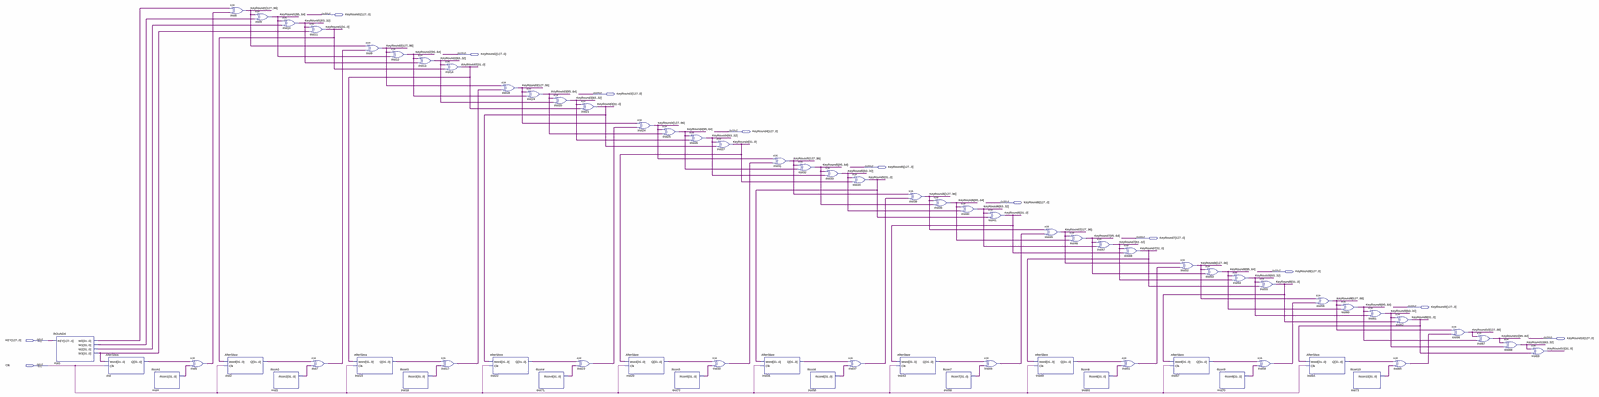
[diagram p0: schematic sheet, whole]
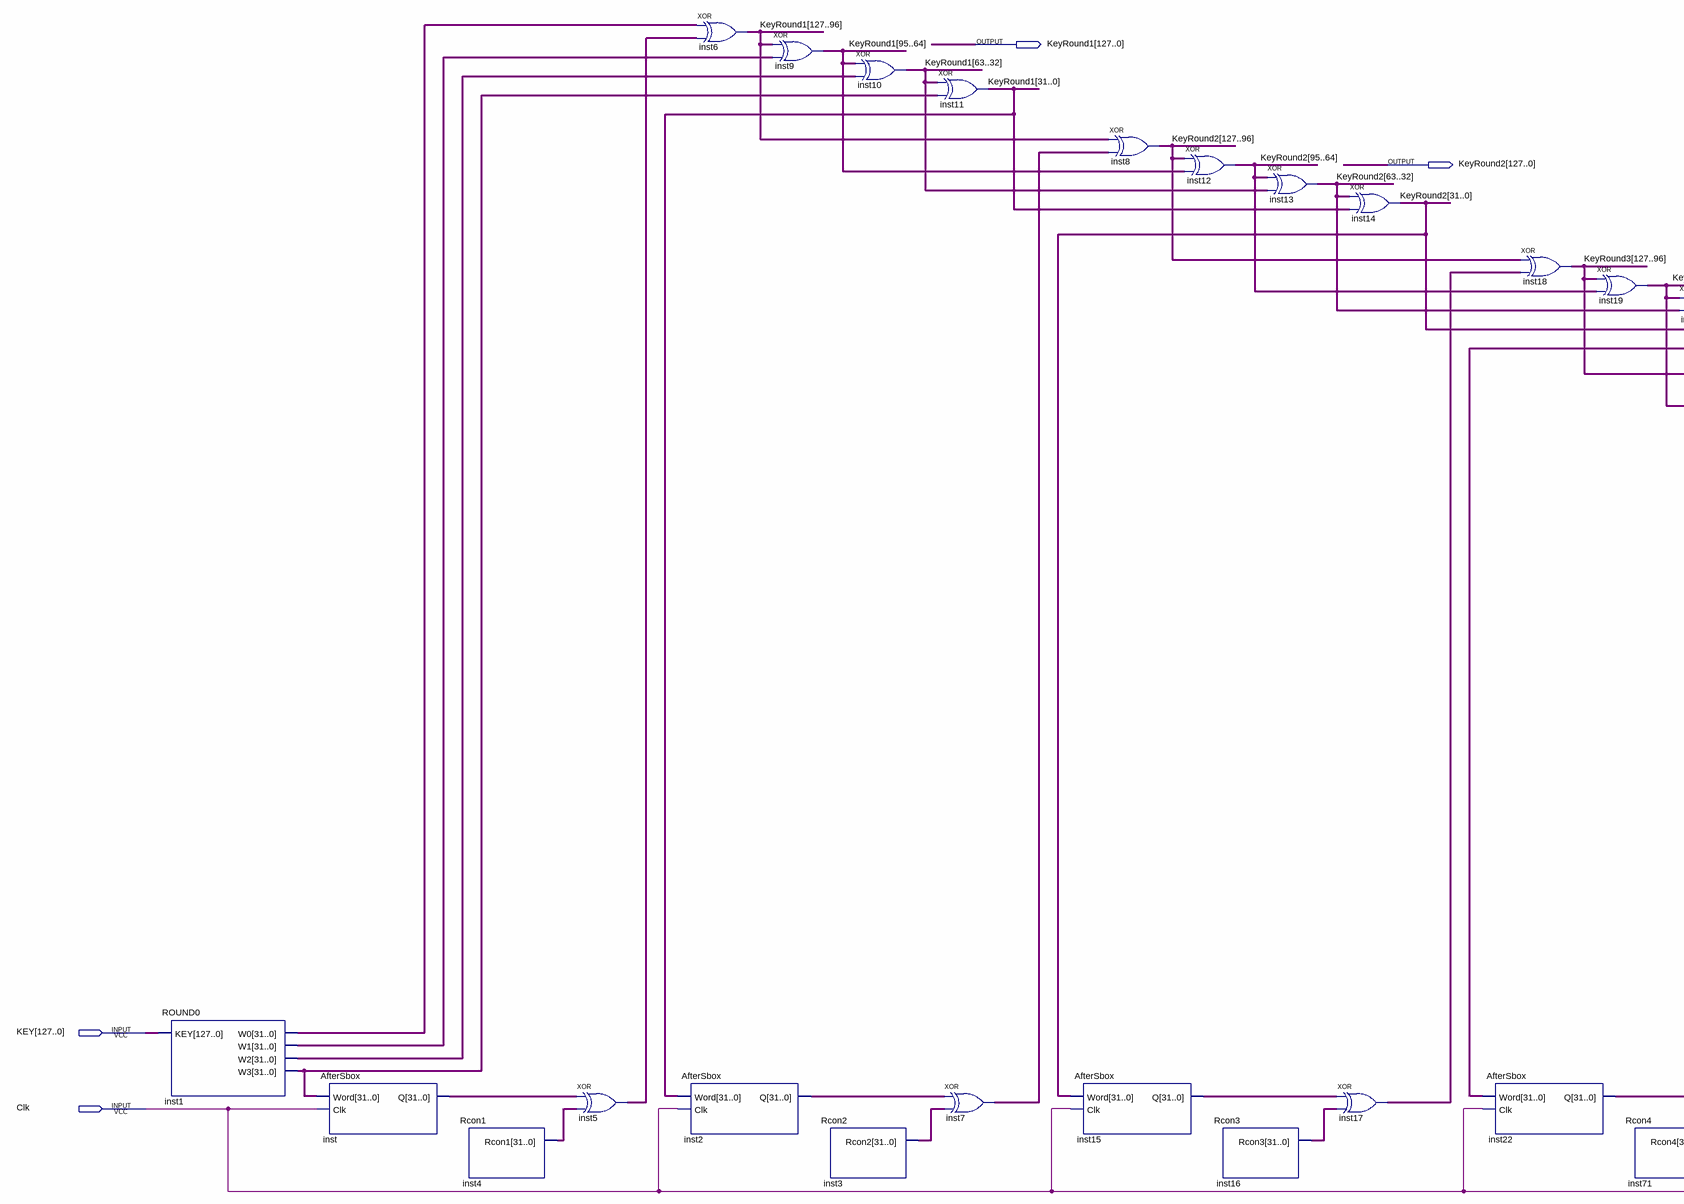
[diagram p1: schematic sheet, left part]
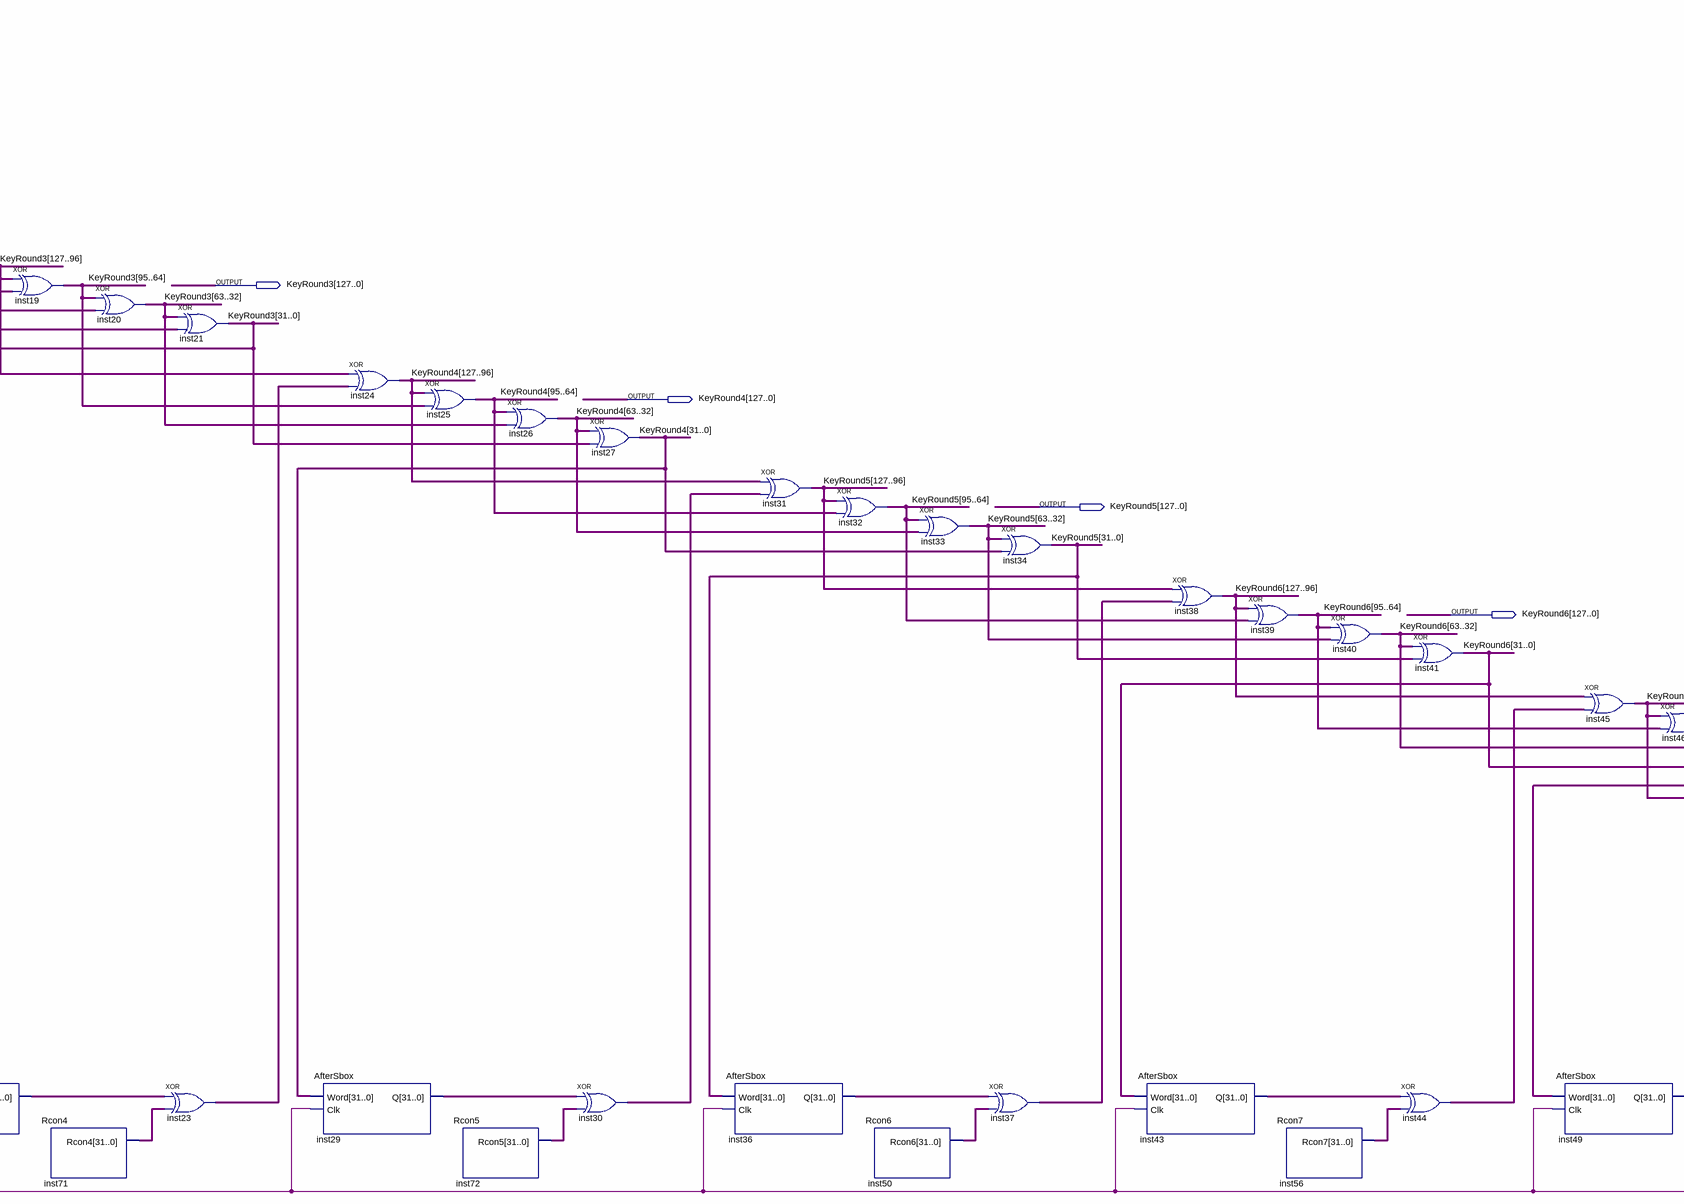
[diagram p2: schematic sheet, centre part]
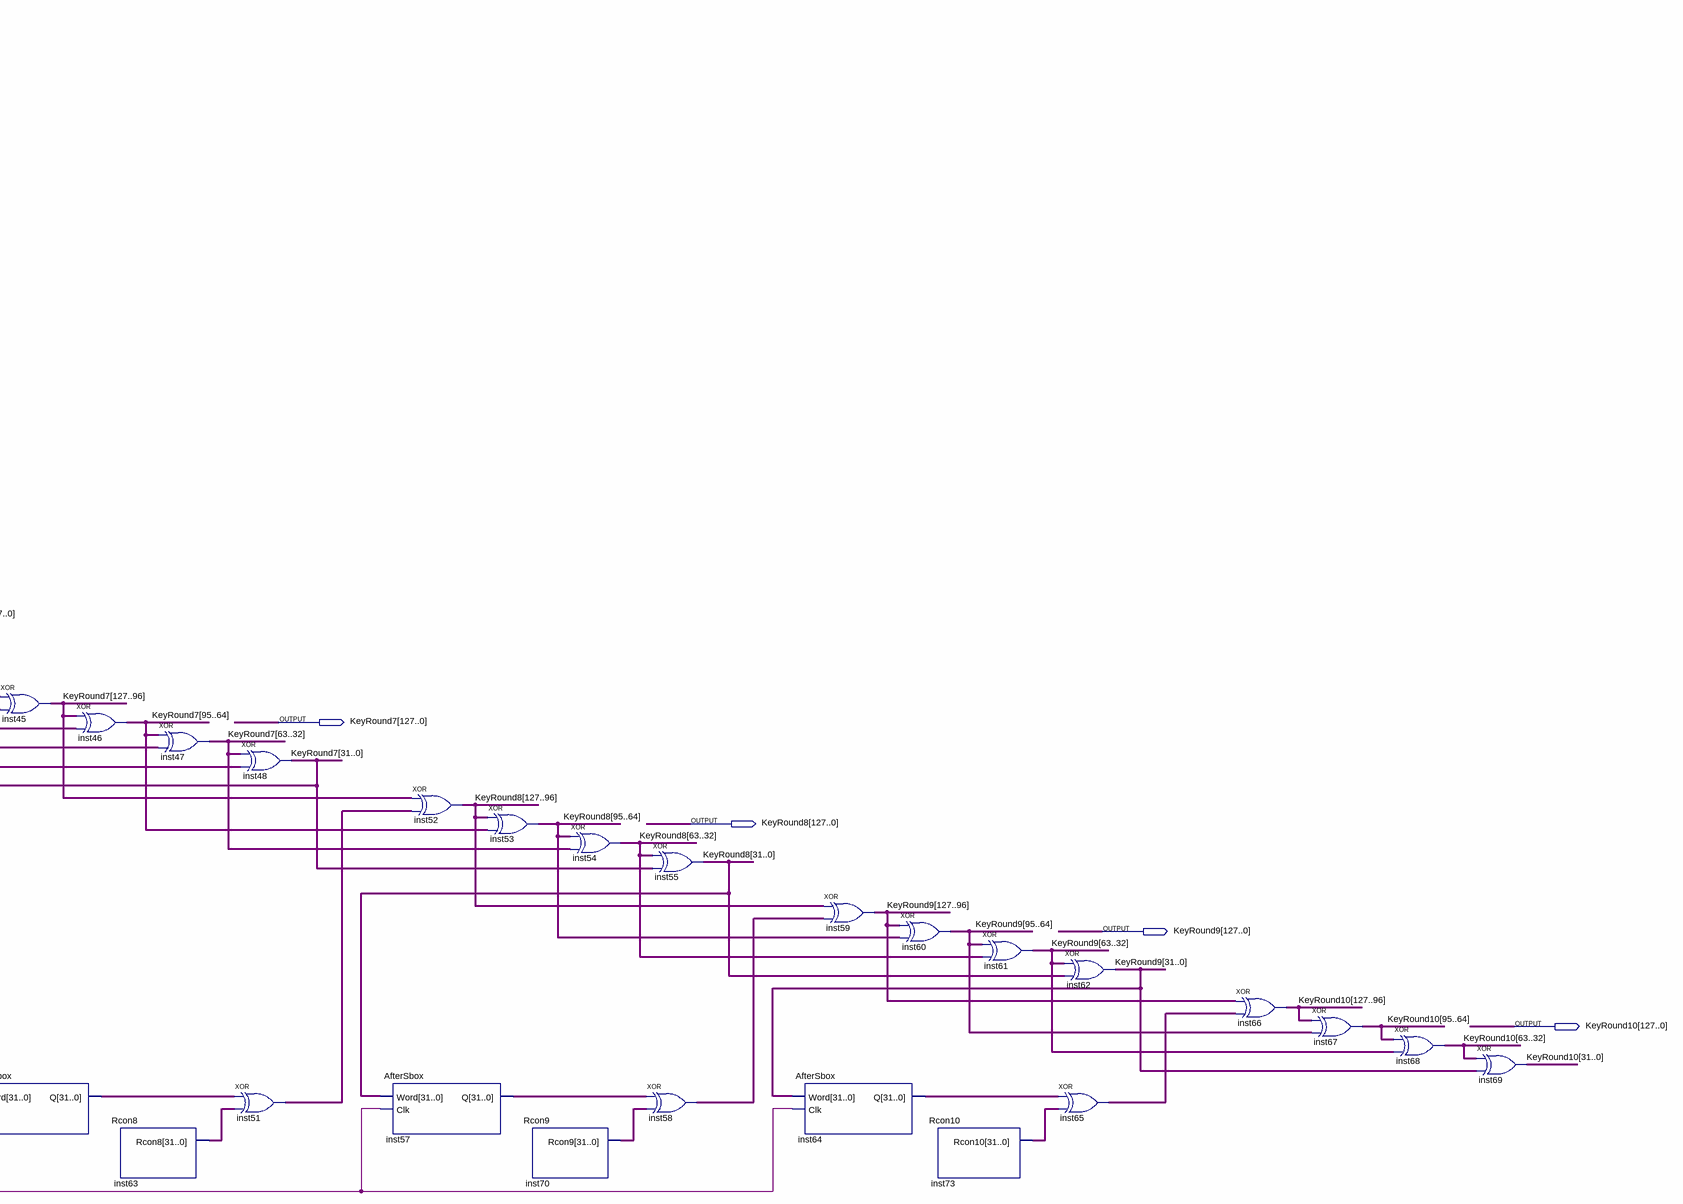
[diagram p3: schematic sheet, right part]
// Quartus schematic KeyExpansions.bdf as structural Verilog: 71 symbols, 12 pins
module KeyExpansions (
  input  [127:0] KEY,
  input  Clk,
  output [127:0] KeyRound1,
  output [127:0] KeyRound2,
  output [127:0] KeyRound3,
  output [127:0] KeyRound4,
  output [127:0] KeyRound5,
  output [127:0] KeyRound6,
  output [127:0] KeyRound7,
  output [127:0] KeyRound8,
  output [127:0] KeyRound9,
  output [127:0] KeyRound10
);

  wire [31:0] inst1_w0, inst1_w1, inst1_w2, inst1_w3, inst2_q, inst3_rcon2, inst4_rcon1, inst5_out,
       inst7_out, inst15_q, inst16_rcon3, inst17_out, inst22_q, inst23_out, inst29_q, inst30_out, inst36_q,
       inst37_out, inst43_q, inst44_out, inst49_q, inst50_rcon6, inst51_out, inst56_rcon7, inst57_q,
       inst58_out, inst63_rcon8, inst64_q, inst65_out, inst70_rcon9, inst71_rcon4, inst72_rcon5,
       inst73_rcon10, inst_q;

  ROUND0 inst1 (.KEY(KEY), .W0(inst1_w0), .W1(inst1_w1), .W2(inst1_w2), .W3(inst1_w3));
  AfterSbox inst (.Word(inst1_w3), .Clk(Clk), .Q(inst_q));
  Rcon1 inst4 (.Rcon1(inst4_rcon1));
  assign inst5_out = inst_q ^ inst4_rcon1;  // XOR inst5, 32 bits wide
  assign KeyRound1[127:96] = inst1_w0 ^ inst5_out;  // XOR inst6, 32 bits wide
  AfterSbox inst2 (.Word(KeyRound1[31:0]), .Clk(Clk), .Q(inst2_q));
  assign KeyRound1[95:64] = KeyRound1[127:96] ^ inst1_w1;  // XOR inst9, 32 bits wide
  Rcon2 inst3 (.Rcon2(inst3_rcon2));
  assign KeyRound1[63:32] = KeyRound1[95:64] ^ inst1_w2;  // XOR inst10, 32 bits wide
  assign KeyRound1[31:0] = KeyRound1[63:32] ^ inst1_w3;  // XOR inst11, 32 bits wide
  assign inst7_out = inst2_q ^ inst3_rcon2;  // XOR inst7, 32 bits wide
  AfterSbox inst15 (.Word(KeyRound2[31:0]), .Clk(Clk), .Q(inst15_q));
  assign KeyRound2[127:96] = KeyRound1[127:96] ^ inst7_out;  // XOR inst8, 32 bits wide
  assign KeyRound2[95:64] = KeyRound2[127:96] ^ KeyRound1[95:64];  // XOR inst12, 32 bits wide
  Rcon3 inst16 (.Rcon3(inst16_rcon3));
  assign KeyRound2[63:32] = KeyRound2[95:64] ^ KeyRound1[63:32];  // XOR inst13, 32 bits wide
  assign KeyRound2[31:0] = KeyRound2[63:32] ^ KeyRound1[31:0];  // XOR inst14, 32 bits wide
  assign inst17_out = inst15_q ^ inst16_rcon3;  // XOR inst17, 32 bits wide
  AfterSbox inst22 (.Word(KeyRound3[31:0]), .Clk(Clk), .Q(inst22_q));
  assign KeyRound3[127:96] = KeyRound2[127:96] ^ inst17_out;  // XOR inst18, 32 bits wide
  assign KeyRound3[95:64] = KeyRound3[127:96] ^ KeyRound2[95:64];  // XOR inst19, 32 bits wide
  Rcon4 inst71 (.Rcon4(inst71_rcon4));
  assign KeyRound3[63:32] = KeyRound3[95:64] ^ KeyRound2[63:32];  // XOR inst20, 32 bits wide
  assign KeyRound3[31:0] = KeyRound3[63:32] ^ KeyRound2[31:0];  // XOR inst21, 32 bits wide
  assign inst23_out = inst22_q ^ inst71_rcon4;  // XOR inst23, 32 bits wide
  AfterSbox inst29 (.Word(KeyRound4[31:0]), .Clk(Clk), .Q(inst29_q));
  assign KeyRound4[127:96] = KeyRound3[127:96] ^ inst23_out;  // XOR inst24, 32 bits wide
  assign KeyRound4[95:64] = KeyRound4[127:96] ^ KeyRound3[95:64];  // XOR inst25, 32 bits wide
  Rcon5 inst72 (.Rcon5(inst72_rcon5));
  assign KeyRound4[63:32] = KeyRound4[95:64] ^ KeyRound3[63:32];  // XOR inst26, 32 bits wide
  assign inst30_out = inst29_q ^ inst72_rcon5;  // XOR inst30, 32 bits wide
  assign KeyRound4[31:0] = KeyRound4[63:32] ^ KeyRound3[31:0];  // XOR inst27, 32 bits wide
  AfterSbox inst36 (.Word(KeyRound5[31:0]), .Clk(Clk), .Q(inst36_q));
  assign KeyRound5[127:96] = KeyRound4[127:96] ^ inst30_out;  // XOR inst31, 32 bits wide
  assign KeyRound5[95:64] = KeyRound5[127:96] ^ KeyRound4[95:64];  // XOR inst32, 32 bits wide
  Rcon6 inst50 (.Rcon6(inst50_rcon6));
  assign KeyRound5[63:32] = KeyRound5[95:64] ^ KeyRound4[63:32];  // XOR inst33, 32 bits wide
  assign inst37_out = inst36_q ^ inst50_rcon6;  // XOR inst37, 32 bits wide
  assign KeyRound5[31:0] = KeyRound5[63:32] ^ KeyRound4[31:0];  // XOR inst34, 32 bits wide
  AfterSbox inst43 (.Word(KeyRound6[31:0]), .Clk(Clk), .Q(inst43_q));
  assign KeyRound6[127:96] = KeyRound5[127:96] ^ inst37_out;  // XOR inst38, 32 bits wide
  assign KeyRound6[95:64] = KeyRound6[127:96] ^ KeyRound5[95:64];  // XOR inst39, 32 bits wide
  Rcon7 inst56 (.Rcon7(inst56_rcon7));
  assign KeyRound6[63:32] = KeyRound6[95:64] ^ KeyRound5[63:32];  // XOR inst40, 32 bits wide
  assign KeyRound6[31:0] = KeyRound6[63:32] ^ KeyRound5[31:0];  // XOR inst41, 32 bits wide
  assign inst44_out = inst43_q ^ inst56_rcon7;  // XOR inst44, 32 bits wide
  assign KeyRound7[127:96] = KeyRound6[127:96] ^ inst44_out;  // XOR inst45, 32 bits wide
  AfterSbox inst49 (.Word(KeyRound7[31:0]), .Clk(Clk), .Q(inst49_q));
  assign KeyRound7[95:64] = KeyRound7[127:96] ^ KeyRound6[95:64];  // XOR inst46, 32 bits wide
  Rcon8 inst63 (.Rcon8(inst63_rcon8));
  assign KeyRound7[63:32] = KeyRound7[95:64] ^ KeyRound6[63:32];  // XOR inst47, 32 bits wide
  assign KeyRound7[31:0] = KeyRound7[63:32] ^ KeyRound6[31:0];  // XOR inst48, 32 bits wide
  assign inst51_out = inst49_q ^ inst63_rcon8;  // XOR inst51, 32 bits wide
  assign KeyRound8[127:96] = KeyRound7[127:96] ^ inst51_out;  // XOR inst52, 32 bits wide
  AfterSbox inst57 (.Word(KeyRound8[31:0]), .Clk(Clk), .Q(inst57_q));
  assign KeyRound8[95:64] = KeyRound8[127:96] ^ KeyRound7[95:64];  // XOR inst53, 32 bits wide
  Rcon9 inst70 (.Rcon9(inst70_rcon9));
  assign KeyRound8[63:32] = KeyRound8[95:64] ^ KeyRound7[63:32];  // XOR inst54, 32 bits wide
  assign KeyRound8[31:0] = KeyRound8[63:32] ^ KeyRound7[31:0];  // XOR inst55, 32 bits wide
  assign inst58_out = inst57_q ^ inst70_rcon9;  // XOR inst58, 32 bits wide
  assign KeyRound9[127:96] = KeyRound8[127:96] ^ inst58_out;  // XOR inst59, 32 bits wide
  AfterSbox inst64 (.Word(KeyRound9[31:0]), .Clk(Clk), .Q(inst64_q));
  assign KeyRound9[95:64] = KeyRound9[127:96] ^ KeyRound8[95:64];  // XOR inst60, 32 bits wide
  Rcon10 inst73 (.Rcon10(inst73_rcon10));
  assign KeyRound9[63:32] = KeyRound9[95:64] ^ KeyRound8[63:32];  // XOR inst61, 32 bits wide
  assign KeyRound9[31:0] = KeyRound9[63:32] ^ KeyRound8[31:0];  // XOR inst62, 32 bits wide
  assign inst65_out = inst64_q ^ inst73_rcon10;  // XOR inst65, 32 bits wide
  assign KeyRound10[127:96] = KeyRound9[127:96] ^ inst65_out;  // XOR inst66, 32 bits wide
  assign KeyRound10[95:64] = KeyRound10[127:96] ^ KeyRound9[95:64];  // XOR inst67, 32 bits wide
  assign KeyRound10[63:32] = KeyRound10[95:64] ^ KeyRound9[63:32];  // XOR inst68, 32 bits wide
  assign KeyRound10[31:0] = KeyRound10[63:32] ^ KeyRound9[31:0];  // XOR inst69, 32 bits wide
endmodule
